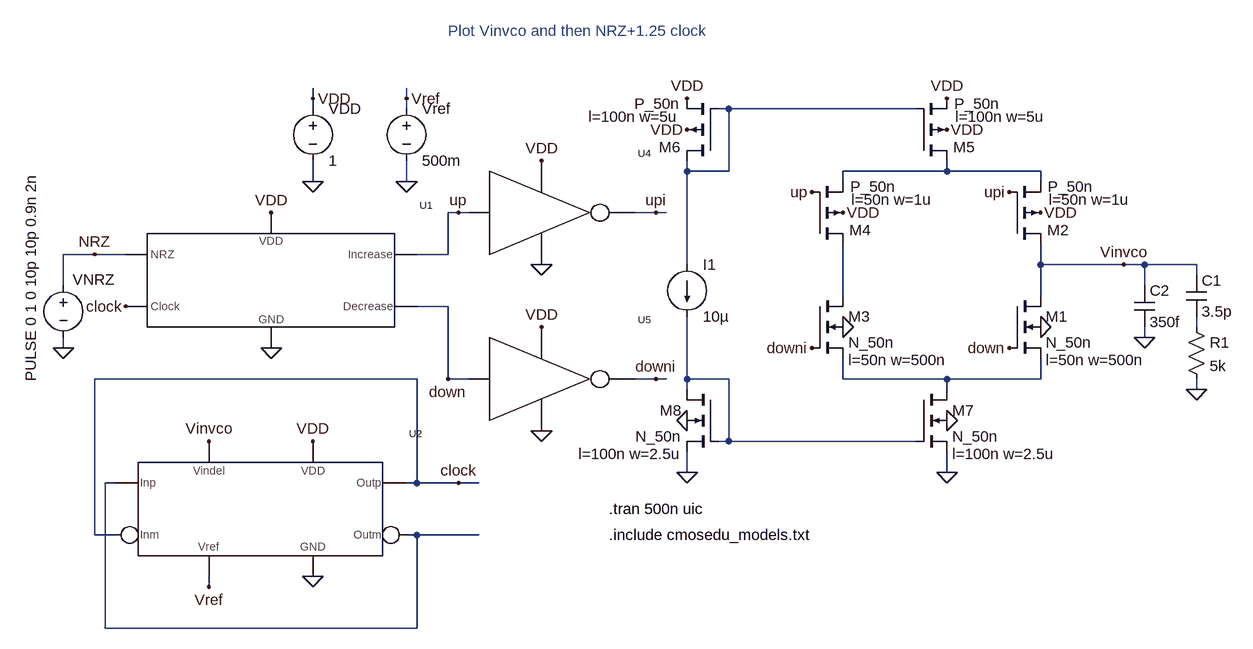
[diagram p0: schematic Fig19_74.asc]
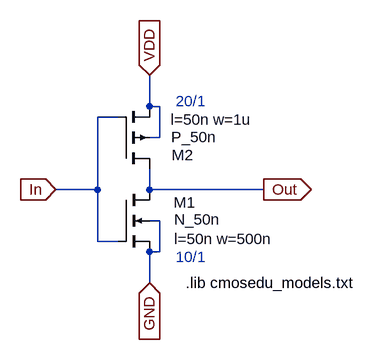
[diagram p1: sub-circuit inv_20_10.asc]
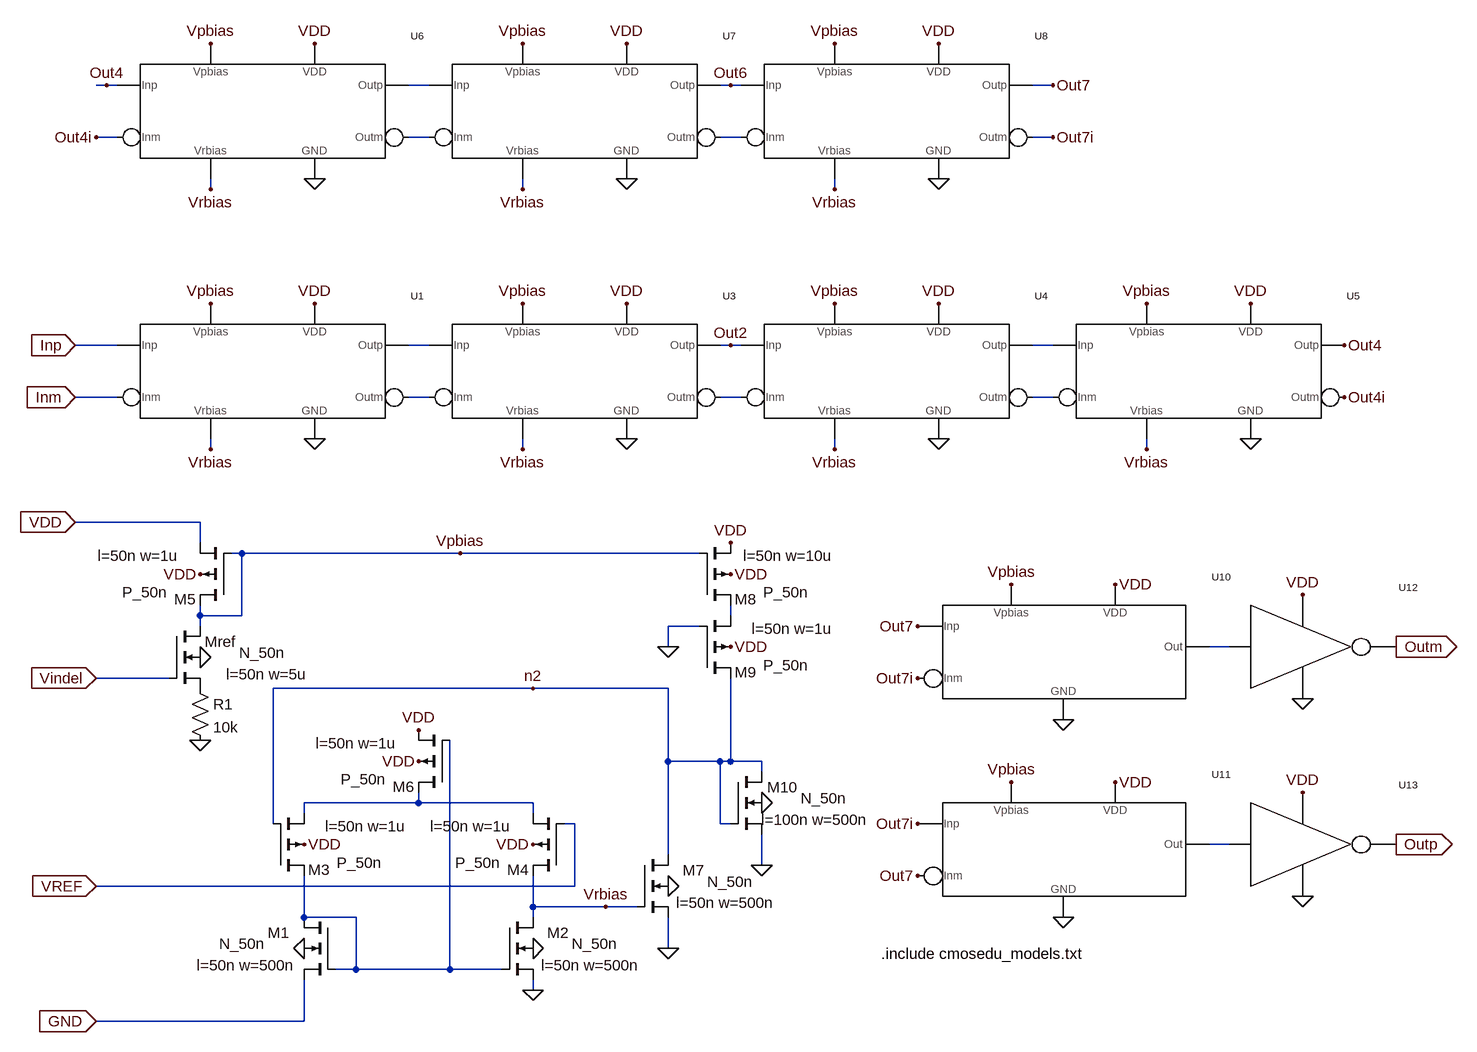
[diagram p2: sub-circuit fig_19_63.asc]
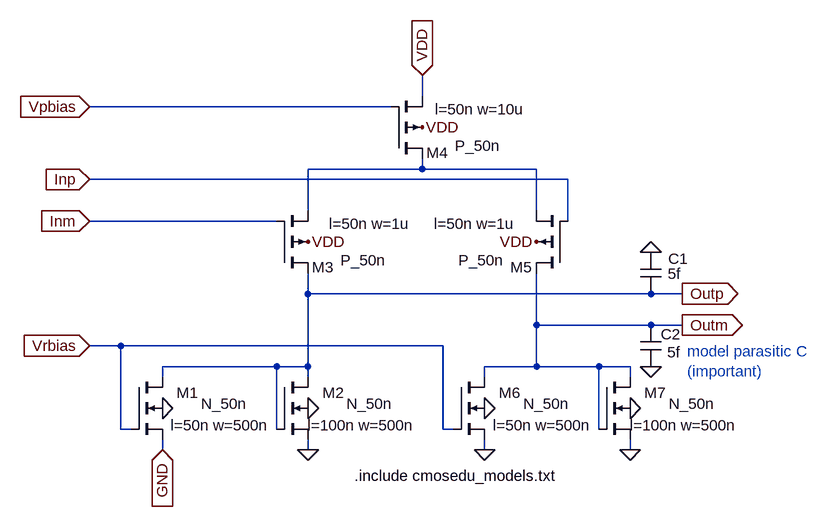
[diagram p3: sub-circuit delay.asc]
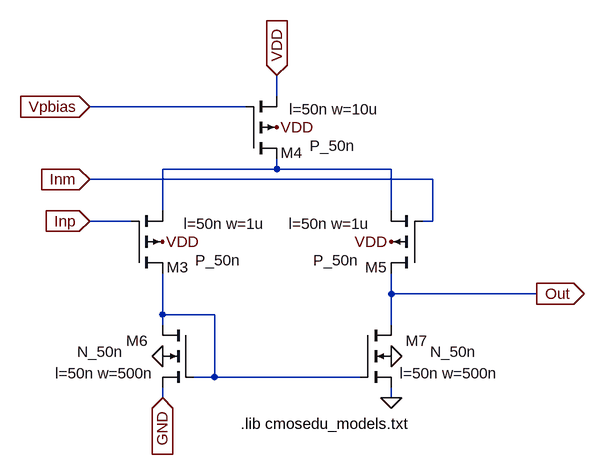
[diagram p4: sub-circuit pdiff.asc]
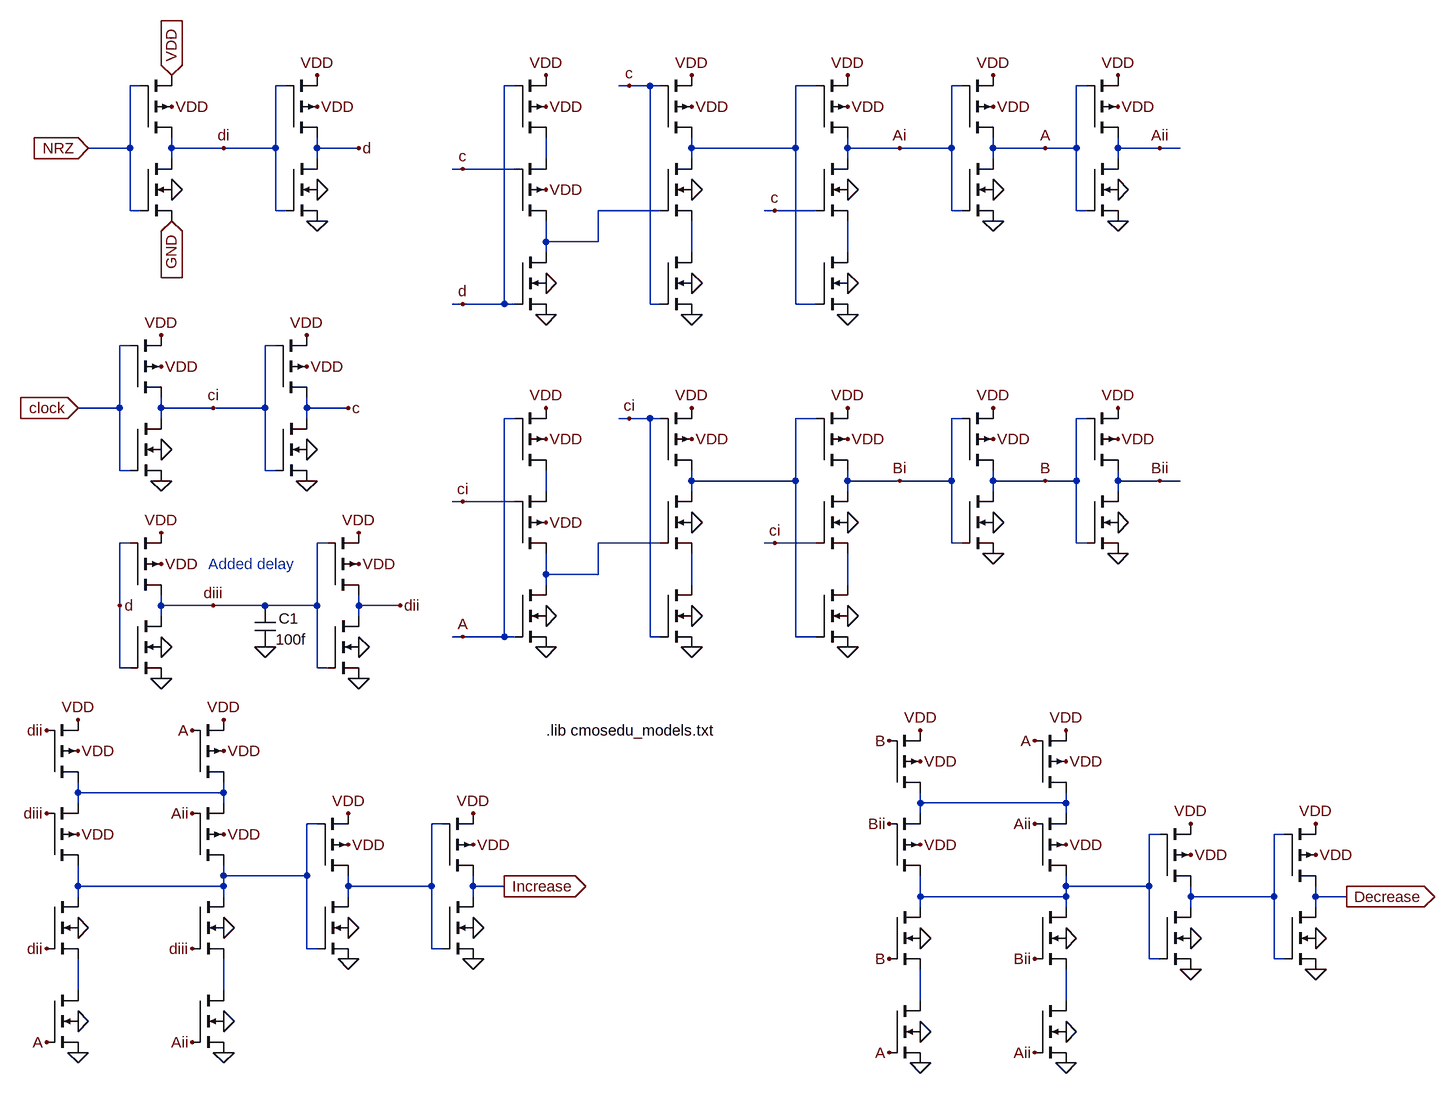
[diagram p5: sub-circuit hogge_pd.asc]
Fig19_74.asc, the LTspice schematic file:
Version 4
SHEET 1 6288 680
WIRE 1760 -1136 1760 -1152
WIRE 1904 -1136 1904 -1152
WIRE 1760 -1120 1760 -1136
WIRE 1904 -1120 1904 -1136
WIRE 2400 -1120 2384 -1120
WIRE 2688 -1120 2400 -1120
WIRE 2336 -1024 2336 -1040
WIRE 2400 -1024 2400 -1120
WIRE 2400 -1024 2336 -1024
WIRE 2736 -1024 2736 -1040
WIRE 2736 -1024 2576 -1024
WIRE 2880 -1024 2736 -1024
WIRE 1760 -1008 1760 -1040
WIRE 1904 -1008 1904 -1040
WIRE 2576 -1008 2576 -1024
WIRE 2880 -1008 2880 -1024
WIRE 1984 -960 1968 -960
WIRE 2000 -960 1984 -960
WIRE 2288 -960 2256 -960
WIRE 2304 -960 2288 -960
WIRE 1424 -896 1376 -896
WIRE 1472 -896 1424 -896
WIRE 1968 -896 1968 -960
WIRE 1968 -896 1920 -896
WIRE 2336 -880 2336 -1024
WIRE 2880 -880 2880 -912
WIRE 3008 -880 2880 -880
WIRE 3040 -880 3008 -880
WIRE 3120 -880 3040 -880
WIRE 3120 -864 3120 -880
WIRE 1376 -848 1376 -896
WIRE 3040 -848 3040 -880
WIRE 2576 -832 2576 -912
WIRE 2880 -832 2880 -880
WIRE 1968 -816 1920 -816
WIRE 3120 -784 3120 -800
WIRE 3040 -768 3040 -784
WIRE 1376 -752 1376 -768
WIRE 1920 -704 1424 -704
WIRE 1968 -704 1968 -816
WIRE 2000 -704 1968 -704
WIRE 2288 -704 2256 -704
WIRE 2304 -704 2288 -704
WIRE 2336 -704 2336 -800
WIRE 2400 -704 2336 -704
WIRE 2576 -704 2576 -736
WIRE 2736 -704 2576 -704
WIRE 2880 -704 2880 -736
WIRE 2880 -704 2736 -704
WIRE 2336 -688 2336 -704
WIRE 2736 -688 2736 -704
WIRE 3120 -688 3120 -704
WIRE 2400 -608 2400 -704
WIRE 2400 -608 2384 -608
WIRE 2688 -608 2400 -608
WIRE 2336 -560 2336 -592
WIRE 2736 -560 2736 -592
WIRE 1456 -544 1440 -544
WIRE 1920 -544 1920 -704
WIRE 1920 -544 1904 -544
WIRE 1984 -544 1920 -544
WIRE 2016 -544 1984 -544
WIRE 1424 -464 1424 -704
WIRE 1456 -464 1424 -464
WIRE 1920 -464 1904 -464
WIRE 2016 -464 1920 -464
WIRE 1600 -384 1600 -400
WIRE 1440 -320 1440 -544
WIRE 1920 -320 1920 -464
WIRE 1920 -320 1440 -320
FLAG 1376 -752 0
FLAG 1760 -1008 0
FLAG 1760 -1136 VDD
FLAG 1696 -960 VDD
FLAG 1696 -752 0
FLAG 1424 -896 NRZ
FLAG 2112 -1040 VDD
FLAG 2112 -880 0
FLAG 2880 -784 0
FLAG 2880 -960 VDD
FLAG 2112 -784 VDD
FLAG 2112 -624 0
FLAG 1984 -960 up
FLAG 2288 -960 upi
FLAG 1968 -704 down
FLAG 2288 -704 downi
FLAG 3040 -768 0
FLAG 2832 -992 upi
FLAG 2832 -752 down
FLAG 2576 -784 0
FLAG 2576 -960 VDD
FLAG 2528 -992 up
FLAG 2528 -752 downi
FLAG 2736 -1136 VDD
FLAG 2736 -1088 VDD
FLAG 2336 -1136 VDD
FLAG 2336 -1088 VDD
FLAG 2736 -640 0
FLAG 2736 -560 0
FLAG 2336 -640 0
FLAG 2336 -560 0
FLAG 1472 -816 clock
FLAG 1904 -1008 0
FLAG 1904 -1136 Vref
FLAG 3008 -880 Vinvco
FLAG 1760 -400 0
FLAG 1760 -608 VDD
FLAG 1600 -608 Vinvco
FLAG 1600 -384 Vref
FLAG 1984 -544 clock
FLAG 3120 -688 0
SYMBOL voltage 1376 -864 R0
WINDOW 0 14 7 Left 2
WINDOW 3 -50 164 VLeft 2
WINDOW 123 0 0 Left 2
WINDOW 39 0 0 Left 2
SYMATTR InstName VNRZ
SYMATTR Value PULSE 0 1 0 10p 10p 0.9n 2n
SYMBOL voltage 1760 -1136 R0
WINDOW 123 0 0 Left 2
WINDOW 39 0 0 Left 2
SYMATTR InstName VDD
SYMATTR Value 1
SYMBOL INV_20_10 2032 -1024 R0
SYMATTR InstName U4
SYMBOL nmos4 2832 -832 R0
WINDOW 123 56 99 Left 2
SYMATTR Value2 l=50n w=500n
SYMATTR InstName M1
SYMATTR Value N_50n
SYMBOL pmos4 2832 -912 M180
WINDOW 0 58 21 Left 2
WINDOW 3 59 88 Left 2
WINDOW 123 61 68 Left 2
SYMATTR InstName M2
SYMATTR Value P_50n
SYMATTR Value2 l=50n w=1u
SYMBOL INV_20_10 2032 -768 R0
SYMATTR InstName U5
SYMBOL cap 3024 -848 R0
SYMATTR InstName C2
SYMATTR Value 350f
SYMBOL nmos4 2528 -832 R0
WINDOW 123 56 99 Left 2
SYMATTR Value2 l=50n w=500n
SYMATTR InstName M3
SYMATTR Value N_50n
SYMBOL pmos4 2528 -912 M180
WINDOW 0 58 21 Left 2
WINDOW 3 59 88 Left 2
WINDOW 123 61 68 Left 2
SYMATTR InstName M4
SYMATTR Value P_50n
SYMATTR Value2 l=50n w=1u
SYMBOL pmos4 2688 -1040 M180
WINDOW 0 58 21 Left 2
WINDOW 3 59 88 Left 2
WINDOW 123 61 68 Left 2
SYMATTR InstName M5
SYMATTR Value P_50n
SYMATTR Value2 l=100n w=5u
SYMBOL pmos4 2384 -1040 R180
WINDOW 0 58 21 Left 2
WINDOW 3 59 88 Left 2
WINDOW 123 61 68 Left 2
SYMATTR InstName M6
SYMATTR Value P_50n
SYMATTR Value2 l=100n w=5u
SYMBOL nmos4 2688 -688 R0
WINDOW 123 56 99 Left 2
SYMATTR Value2 l=100n w=2.5u
SYMATTR InstName M7
SYMATTR Value N_50n
SYMBOL nmos4 2384 -688 M0
WINDOW 123 56 99 Left 2
SYMATTR Value2 l=100n w=2.5u
SYMATTR InstName M8
SYMATTR Value N_50n
SYMBOL current 2336 -880 R0
SYMATTR InstName I1
SYMATTR Value 10µ
SYMBOL voltage 1904 -1136 R0
WINDOW 123 0 0 Left 2
WINDOW 39 0 0 Left 2
SYMATTR InstName Vref
SYMATTR Value 500m
SYMBOL Fig_19_63 1488 -496 R0
SYMATTR InstName U2
SYMBOL cap 3104 -864 R0
SYMATTR InstName C1
SYMATTR Value 3.5p
SYMBOL res 3104 -800 R0
SYMATTR InstName R1
SYMATTR Value 5k
SYMBOL Hogge_PD 1504 -848 R0
SYMATTR InstName U1
TEXT 2216 -504 Left 2 !.tran 500n uic
TEXT 2216 -464 Left 2 !.include cmosedu_models.txt
TEXT 1968 -1240 Left 2 ;Plot Vinvco and then NRZ+1.25 clock

inv_20_10.asc, the sub-circuit schematic file:
Version 4
SHEET 1 1136 680
WIRE 448 -304 448 -352
WIRE 464 -304 448 -304
WIRE 400 -288 368 -288
WIRE 464 -256 464 -304
WIRE 464 -256 448 -256
WIRE 368 -176 368 -288
WIRE 368 -176 304 -176
WIRE 448 -176 448 -208
WIRE 624 -176 448 -176
WIRE 464 -128 448 -128
WIRE 368 -96 368 -176
WIRE 400 -96 368 -96
WIRE 464 -80 464 -128
WIRE 464 -80 448 -80
WIRE 448 -32 448 -80
FLAG 304 -176 In
IOPIN 304 -176 In
FLAG 448 -352 VDD
IOPIN 448 -352 In
FLAG 448 -32 GND
IOPIN 448 -32 In
FLAG 624 -176 Out
IOPIN 624 -176 Out
SYMBOL nmos4 400 -176 R0
WINDOW 0 119 20 Right 2
WINDOW 3 157 46 Right 2
WINDOW 123 238 76 Right 2
SYMATTR InstName M1
SYMATTR Value N_50n
SYMATTR Value2 l=50n w=500n
SYMBOL pmos4 400 -208 M180
WINDOW 0 116 21 Right 2
WINDOW 3 151 49 Right 2
WINDOW 123 206 76 Right 2
SYMATTR InstName M2
SYMATTR Value P_50n
SYMATTR Value2 l=50n w=1u
TEXT 488 -312 Left 2 ;20/1
TEXT 488 -72 Left 2 ;10/1
TEXT 504 -32 Left 2 !.lib cmosedu_models.txt

fig_19_63.asc, the sub-circuit schematic file:
Version 4
SHEET 1 4588 680
WIRE 656 -1792 640 -1792
WIRE 672 -1792 656 -1792
WIRE 1152 -1792 1120 -1792
WIRE 1616 -1792 1600 -1792
WIRE 1632 -1792 1616 -1792
WIRE 2112 -1792 2080 -1792
WIRE 672 -1712 640 -1712
WIRE 1152 -1712 1120 -1712
WIRE 1632 -1712 1600 -1712
WIRE 2112 -1712 2080 -1712
WIRE 816 -1632 816 -1648
WIRE 1296 -1632 1296 -1648
WIRE 1776 -1632 1776 -1648
WIRE 672 -1392 608 -1392
WIRE 1152 -1392 1120 -1392
WIRE 1616 -1392 1600 -1392
WIRE 1632 -1392 1616 -1392
WIRE 2112 -1392 2080 -1392
WIRE 672 -1312 608 -1312
WIRE 1152 -1312 1120 -1312
WIRE 1632 -1312 1600 -1312
WIRE 2112 -1312 2080 -1312
WIRE 816 -1232 816 -1248
WIRE 1296 -1232 1296 -1248
WIRE 1776 -1232 1776 -1248
WIRE 2256 -1232 2256 -1248
WIRE 800 -1120 608 -1120
WIRE 800 -1088 800 -1120
WIRE 864 -1072 848 -1072
WIRE 1200 -1072 864 -1072
WIRE 1568 -1072 1200 -1072
WIRE 800 -976 800 -992
WIRE 864 -976 864 -1072
WIRE 864 -976 800 -976
WIRE 1616 -976 1616 -992
WIRE 800 -960 800 -976
WIRE 1568 -960 1520 -960
WIRE 1520 -928 1520 -960
WIRE 2384 -928 2352 -928
WIRE 752 -880 640 -880
WIRE 1312 -864 912 -864
WIRE 1520 -864 1312 -864
WIRE 1520 -752 1520 -864
WIRE 1600 -752 1520 -752
WIRE 1616 -752 1616 -880
WIRE 1616 -752 1600 -752
WIRE 1664 -752 1616 -752
WIRE 1664 -736 1664 -752
WIRE 1136 -688 1136 -704
WIRE 1136 -688 960 -688
WIRE 1312 -688 1136 -688
WIRE 960 -672 960 -688
WIRE 1312 -672 1312 -688
WIRE 912 -656 912 -864
WIRE 1376 -656 1360 -656
WIRE 1600 -656 1600 -752
WIRE 1616 -656 1600 -656
WIRE 2384 -624 2352 -624
WIRE 1520 -608 1520 -752
WIRE 1664 -592 1664 -640
WIRE 1376 -560 1376 -656
WIRE 1376 -560 640 -560
WIRE 1312 -528 1312 -576
WIRE 1424 -528 1312 -528
WIRE 1472 -528 1424 -528
WIRE 960 -512 960 -576
WIRE 1040 -512 960 -512
WIRE 1312 -512 1312 -528
WIRE 1520 -464 1520 -512
WIRE 1040 -432 1040 -512
WIRE 1040 -432 1008 -432
WIRE 1184 -432 1184 -784
WIRE 1184 -432 1040 -432
WIRE 1264 -432 1184 -432
WIRE 1312 -400 1312 -416
WIRE 960 -352 960 -416
WIRE 960 -352 640 -352
FLAG 960 -464 0
FLAG 960 -624 VDD
FLAG 1312 -624 VDD
FLAG 1312 -464 0
FLAG 800 -1040 VDD
FLAG 1520 -560 0
FLAG 1520 -464 0
FLAG 1136 -752 VDD
FLAG 1136 -800 VDD
FLAG 1312 -400 0
FLAG 800 -912 0
FLAG 800 -784 0
FLAG 1616 -1040 VDD
FLAG 1616 -1088 VDD
FLAG 1616 -928 VDD
FLAG 1520 -928 0
FLAG 1664 -688 0
FLAG 1664 -592 0
FLAG 1424 -528 Vrbias
FLAG 1312 -864 n2
FLAG 1200 -1072 Vpbias
FLAG 976 -1456 VDD
FLAG 976 -1248 0
FLAG 816 -1456 Vpbias
FLAG 816 -1232 Vrbias
FLAG 1456 -1456 VDD
FLAG 1456 -1248 0
FLAG 1296 -1456 Vpbias
FLAG 1296 -1232 Vrbias
FLAG 1936 -1456 VDD
FLAG 1936 -1248 0
FLAG 1776 -1456 Vpbias
FLAG 1776 -1232 Vrbias
FLAG 2416 -1456 VDD
FLAG 2416 -1248 0
FLAG 2256 -1456 Vpbias
FLAG 2256 -1232 Vrbias
FLAG 976 -1856 VDD
FLAG 976 -1648 0
FLAG 816 -1856 Vpbias
FLAG 816 -1632 Vrbias
FLAG 1456 -1856 VDD
FLAG 1456 -1648 0
FLAG 1296 -1856 Vpbias
FLAG 1296 -1632 Vrbias
FLAG 1936 -1856 VDD
FLAG 1936 -1648 0
FLAG 1776 -1856 Vpbias
FLAG 1776 -1632 Vrbias
FLAG 1616 -1392 Out2
FLAG 656 -1792 Out4
FLAG 1616 -1792 Out6
FLAG 2560 -1392 Out4
FLAG 2560 -1312 Out4i
FLAG 640 -1712 Out4i
FLAG 2128 -816 0
FLAG 2128 -512 0
FLAG 2208 -1024 VDD
FLAG 2208 -720 VDD
FLAG 1904 -960 Out7
FLAG 1904 -576 Out7
FLAG 1904 -880 Out7i
FLAG 1904 -656 Out7i
FLAG 2048 -1024 Vpbias
FLAG 2048 -720 Vpbias
FLAG 2496 -848 0
FLAG 2496 -544 0
FLAG 2496 -1008 VDD
FLAG 2496 -704 VDD
FLAG 2640 -928 Outm
IOPIN 2640 -928 Out
FLAG 2640 -624 Outp
IOPIN 2640 -624 Out
FLAG 640 -880 Vindel
IOPIN 640 -880 In
FLAG 640 -560 VREF
IOPIN 640 -560 In
FLAG 608 -1392 Inp
IOPIN 608 -1392 In
FLAG 608 -1312 Inm
IOPIN 608 -1312 In
FLAG 608 -1120 VDD
IOPIN 608 -1120 In
FLAG 640 -352 GND
IOPIN 640 -352 In
FLAG 2112 -1792 Out7
FLAG 2112 -1712 Out7i
SYMBOL nmos4 1008 -512 M0
WINDOW 0 104 24 Right 2
WINDOW 3 179 41 Right 2
WINDOW 123 213 74 Right 2
SYMATTR InstName M1
SYMATTR Value N_50n
SYMATTR Value2 l=50n w=500n
SYMBOL pmos4 912 -576 M180
WINDOW 0 88 9 Right 2
WINDOW 3 168 20 Right 2
WINDOW 123 206 76 Right 2
SYMATTR InstName M3
SYMATTR Value P_50n
SYMATTR Value2 l=50n w=1u
SYMBOL pmos4 1360 -576 R180
WINDOW 0 88 9 Right 2
WINDOW 3 168 20 Right 2
WINDOW 123 206 76 Right 2
SYMATTR InstName M4
SYMATTR Value P_50n
SYMATTR Value2 l=50n w=1u
SYMBOL nmos4 1264 -512 R0
WINDOW 0 104 24 Right 2
WINDOW 3 179 41 Right 2
WINDOW 123 213 74 Right 2
SYMATTR InstName M2
SYMATTR Value N_50n
SYMATTR Value2 l=50n w=500n
SYMBOL pmos4 848 -992 R180
WINDOW 0 88 9 Right 2
WINDOW 3 168 20 Right 2
WINDOW 123 206 76 Right 2
SYMATTR InstName M5
SYMATTR Value P_50n
SYMATTR Value2 l=50n w=1u
SYMBOL nmos4 1472 -608 R0
WINDOW 0 104 24 Right 2
WINDOW 3 179 41 Right 2
WINDOW 123 213 74 Right 2
SYMATTR InstName M7
SYMATTR Value N_50n
SYMATTR Value2 l=50n w=500n
SYMBOL pmos4 1184 -704 R180
WINDOW 0 88 9 Right 2
WINDOW 3 168 20 Right 2
WINDOW 123 206 76 Right 2
SYMATTR InstName M6
SYMATTR Value P_50n
SYMATTR Value2 l=50n w=1u
SYMBOL nmos4 752 -960 R0
WINDOW 0 104 24 Right 2
WINDOW 3 179 41 Right 2
WINDOW 123 213 74 Right 2
SYMATTR InstName Mref
SYMATTR Value N_50n
SYMATTR Value2 l=50n w=5u
SYMBOL res 784 -880 R0
SYMATTR InstName R1
SYMATTR Value 10k
SYMBOL pmos4 1568 -992 M180
WINDOW 0 88 9 Right 2
WINDOW 3 168 20 Right 2
WINDOW 123 206 76 Right 2
SYMATTR InstName M8
SYMATTR Value P_50n
SYMATTR Value2 l=50n w=10u
SYMBOL pmos4 1568 -880 M180
WINDOW 0 88 9 Right 2
WINDOW 3 168 20 Right 2
WINDOW 123 206 76 Right 2
SYMATTR InstName M9
SYMATTR Value P_50n
SYMATTR Value2 l=50n w=1u
SYMBOL nmos4 1616 -736 R0
WINDOW 0 104 24 Right 2
WINDOW 3 179 41 Right 2
WINDOW 123 213 74 Right 2
SYMATTR InstName M10
SYMATTR Value N_50n
SYMATTR Value2 l=100n w=500n
SYMBOL delay 704 -1344 R0
SYMATTR InstName U1
SYMBOL delay 1184 -1344 R0
SYMATTR InstName U3
SYMBOL delay 1664 -1344 R0
SYMATTR InstName U4
SYMBOL delay 2144 -1344 R0
SYMATTR InstName U5
SYMBOL delay 704 -1744 R0
SYMATTR InstName U6
SYMBOL delay 1184 -1744 R0
SYMATTR InstName U7
SYMBOL delay 1664 -1744 R0
SYMATTR InstName U8
SYMBOL pdiff 1936 -912 R0
SYMATTR InstName U10
SYMBOL pdiff 1936 -608 R0
SYMATTR InstName U11
SYMBOL INV_20_10 2416 -992 R0
SYMATTR InstName U12
SYMBOL INV_20_10 2416 -688 R0
SYMATTR InstName U13
TEXT 1848 -456 Left 2 !.include cmosedu_models.txt

delay.asc, the sub-circuit schematic file:
Version 4
SHEET 1 6288 680
WIRE 656 -608 656 -640
WIRE 608 -592 144 -592
WIRE 656 -496 656 -512
WIRE 656 -496 480 -496
WIRE 832 -496 656 -496
WIRE 880 -480 144 -480
WIRE 480 -432 480 -496
WIRE 832 -432 832 -496
WIRE 432 -416 144 -416
WIRE 880 -416 880 -480
WIRE 480 -304 480 -336
WIRE 1008 -304 480 -304
WIRE 1056 -304 1008 -304
WIRE 832 -256 832 -336
WIRE 1008 -256 832 -256
WIRE 1056 -256 1008 -256
WIRE 192 -224 144 -224
WIRE 688 -224 192 -224
WIRE 432 -192 256 -192
WIRE 480 -192 480 -304
WIRE 480 -192 432 -192
WIRE 832 -192 832 -256
WIRE 832 -192 752 -192
WIRE 928 -192 832 -192
WIRE 976 -192 928 -192
WIRE 256 -176 256 -192
WIRE 480 -176 480 -192
WIRE 752 -176 752 -192
WIRE 976 -176 976 -192
WIRE 192 -96 192 -224
WIRE 208 -96 192 -96
WIRE 432 -96 432 -192
WIRE 688 -96 688 -224
WIRE 704 -96 688 -96
WIRE 928 -96 928 -192
WIRE 256 -64 256 -80
WIRE 480 -64 480 -80
WIRE 752 -64 752 -80
WIRE 976 -64 976 -80
FLAG 256 -128 0
FLAG 656 -560 VDD
FLAG 480 -384 VDD
FLAG 480 -128 0
FLAG 144 -592 Vpbias
IOPIN 144 -592 In
FLAG 656 -640 VDD
IOPIN 656 -640 In
FLAG 832 -384 VDD
FLAG 144 -416 Inm
IOPIN 144 -416 In
FLAG 144 -480 Inp
IOPIN 144 -480 In
FLAG 480 -64 0
FLAG 752 -128 0
FLAG 976 -128 0
FLAG 976 -64 0
FLAG 752 -64 0
FLAG 144 -224 Vrbias
IOPIN 144 -224 In
FLAG 1056 -304 Outp
IOPIN 1056 -304 Out
FLAG 1056 -256 Outm
IOPIN 1056 -256 Out
FLAG 256 -64 GND
IOPIN 256 -64 In
FLAG 1008 -192 0
FLAG 1008 -368 0
SYMBOL nmos4 208 -176 R0
WINDOW 0 104 24 Right 0
WINDOW 3 179 41 Right 0
WINDOW 123 213 74 Right 0
SYMATTR InstName M1
SYMATTR Value N_50n
SYMATTR Value2 l=50n w=500n
SYMBOL pmos4 608 -512 M180
WINDOW 0 88 9 Right 0
WINDOW 3 168 20 Right 0
WINDOW 123 206 76 Right 0
SYMATTR InstName M4
SYMATTR Value P_50n
SYMATTR Value2 l=50n w=10u
SYMBOL pmos4 432 -336 M180
WINDOW 0 88 9 Right 0
WINDOW 3 168 20 Right 0
WINDOW 123 206 76 Right 0
SYMATTR InstName M3
SYMATTR Value P_50n
SYMATTR Value2 l=50n w=1u
SYMBOL nmos4 432 -176 R0
WINDOW 0 104 24 Right 0
WINDOW 3 179 41 Right 0
WINDOW 123 213 74 Right 0
SYMATTR InstName M2
SYMATTR Value N_50n
SYMATTR Value2 l=100n w=500n
SYMBOL pmos4 880 -336 R180
WINDOW 0 88 9 Right 0
WINDOW 3 168 20 Right 0
WINDOW 123 206 76 Right 0
SYMATTR InstName M5
SYMATTR Value P_50n
SYMATTR Value2 l=50n w=1u
SYMBOL nmos4 704 -176 R0
WINDOW 0 104 24 Right 0
WINDOW 3 179 41 Right 0
WINDOW 123 213 74 Right 0
SYMATTR InstName M6
SYMATTR Value N_50n
SYMATTR Value2 l=50n w=500n
SYMBOL nmos4 928 -176 R0
WINDOW 0 104 24 Right 0
WINDOW 3 179 41 Right 0
WINDOW 123 213 74 Right 0
SYMATTR InstName M7
SYMATTR Value N_50n
SYMATTR Value2 l=100n w=500n
SYMBOL cap 992 -368 R0
WINDOW 0 43 10 Left 0
WINDOW 3 42 33 Left 0
SYMATTR InstName C1
SYMATTR Value 5f
SYMBOL cap 992 -256 R0
WINDOW 0 31 14 Left 0
WINDOW 3 41 42 Left 0
SYMATTR InstName C2
SYMATTR Value 5f
TEXT 552 -24 Left 0 !.include cmosedu_models.txt
TEXT 1064 -216 Left 0 ;model parasitic C\n(important)

pdiff.asc, the sub-circuit schematic file:
Version 4
SHEET 1 6288 680
WIRE 432 -416 368 -416
WIRE 480 -432 480 -496
WIRE 480 -272 480 -336
WIRE 480 -256 480 -272
WIRE 480 -144 480 -160
WIRE 560 -272 480 -272
WIRE 560 -176 528 -176
WIRE 560 -176 560 -272
WIRE 608 -592 368 -592
WIRE 656 -608 656 -640
WIRE 656 -496 480 -496
WIRE 656 -496 656 -512
WIRE 784 -176 560 -176
WIRE 832 -496 656 -496
WIRE 832 -432 832 -496
WIRE 832 -304 832 -336
WIRE 832 -256 832 -304
WIRE 832 -144 832 -160
WIRE 896 -480 368 -480
WIRE 896 -416 880 -416
WIRE 896 -416 896 -480
WIRE 1056 -304 832 -304
FLAG 656 -560 VDD
FLAG 480 -384 VDD
FLAG 368 -592 Vpbias
IOPIN 368 -592 In
FLAG 656 -640 VDD
IOPIN 656 -640 In
FLAG 832 -384 VDD
FLAG 368 -416 Inp
IOPIN 368 -416 In
FLAG 368 -480 Inm
IOPIN 368 -480 In
FLAG 480 -208 0
FLAG 832 -208 0
FLAG 832 -144 0
FLAG 1056 -304 Out
IOPIN 1056 -304 Out
FLAG 480 -144 GND
IOPIN 480 -144 In
SYMBOL pmos4 608 -512 M180
WINDOW 0 88 9 Right 0
WINDOW 3 168 20 Right 0
WINDOW 123 206 76 Right 0
SYMATTR InstName M4
SYMATTR Value P_50n
SYMATTR Value2 l=50n w=10u
SYMBOL pmos4 432 -336 M180
WINDOW 0 88 9 Right 0
WINDOW 3 168 20 Right 0
WINDOW 123 206 76 Right 0
SYMATTR InstName M3
SYMATTR Value P_50n
SYMATTR Value2 l=50n w=1u
SYMBOL pmos4 880 -336 R180
WINDOW 0 88 9 Right 0
WINDOW 3 168 20 Right 0
WINDOW 123 206 76 Right 0
SYMATTR InstName M5
SYMATTR Value P_50n
SYMATTR Value2 l=50n w=1u
SYMBOL nmos4 528 -256 M0
WINDOW 0 104 24 Right 0
WINDOW 3 179 41 Right 0
WINDOW 123 213 74 Right 0
SYMATTR InstName M6
SYMATTR Value N_50n
SYMATTR Value2 l=50n w=500n
SYMBOL nmos4 784 -256 R0
WINDOW 0 104 24 Right 0
WINDOW 3 179 41 Right 0
WINDOW 123 213 74 Right 0
SYMATTR InstName M7
SYMATTR Value N_50n
SYMATTR Value2 l=50n w=500n
TEXT 600 -104 Left 0 !.lib cmosedu_models.txt

hogge_pd.asc, the sub-circuit schematic file:
Version 4
SHEET 1 6288 1628
WIRE 336 544 336 528
WIRE 336 560 336 544
WIRE 336 688 336 656
WIRE 336 704 336 688
WIRE 336 848 336 800
WIRE 400 -48 336 -48
WIRE 400 -48 400 -144
WIRE 400 48 400 -48
WIRE 400 256 400 160
WIRE 400 352 400 256
WIRE 416 -448 352 -448
WIRE 416 -448 416 -544
WIRE 416 -352 416 -448
WIRE 416 -144 400 -144
WIRE 416 48 400 48
WIRE 416 160 400 160
WIRE 416 352 400 352
WIRE 432 -544 416 -544
WIRE 432 -352 416 -352
WIRE 464 -48 464 -64
WIRE 464 -32 464 -48
WIRE 464 256 464 240
WIRE 464 272 464 256
WIRE 480 -448 480 -464
WIRE 480 -432 480 -448
WIRE 544 -48 464 -48
WIRE 544 256 464 256
WIRE 560 -448 480 -448
WIRE 560 544 336 544
WIRE 560 544 560 528
WIRE 560 560 560 544
WIRE 560 672 560 656
WIRE 560 688 336 688
WIRE 560 688 560 672
WIRE 560 704 560 688
WIRE 560 848 560 800
WIRE 624 -48 544 -48
WIRE 624 -48 624 -144
WIRE 624 48 624 -48
WIRE 624 256 544 256
WIRE 640 -448 560 -448
WIRE 640 -448 640 -544
WIRE 640 -352 640 -448
WIRE 640 -144 624 -144
WIRE 640 48 624 48
WIRE 656 -544 640 -544
WIRE 656 -352 640 -352
WIRE 688 -48 688 -64
WIRE 688 -32 688 -48
WIRE 688 672 560 672
WIRE 688 672 688 592
WIRE 688 784 688 672
WIRE 704 -448 704 -464
WIRE 704 -432 704 -448
WIRE 704 256 624 256
WIRE 704 256 704 160
WIRE 704 352 704 256
WIRE 704 592 688 592
WIRE 704 784 688 784
WIRE 720 160 704 160
WIRE 720 352 704 352
WIRE 752 -48 688 -48
WIRE 752 688 752 672
WIRE 752 704 752 688
WIRE 768 -448 704 -448
WIRE 768 256 768 240
WIRE 768 272 768 256
WIRE 832 256 768 256
WIRE 880 688 752 688
WIRE 880 688 880 592
WIRE 880 784 880 688
WIRE 896 592 880 592
WIRE 896 784 880 784
WIRE 928 -416 912 -416
WIRE 928 -208 912 -208
WIRE 928 96 912 96
WIRE 928 304 912 304
WIRE 944 688 944 672
WIRE 944 704 944 688
WIRE 992 -208 928 -208
WIRE 992 -208 992 -544
WIRE 992 304 928 304
WIRE 992 304 992 -32
WIRE 992 688 944 688
WIRE 1008 -544 992 -544
WIRE 1008 -416 928 -416
WIRE 1008 -208 992 -208
WIRE 1008 -32 992 -32
WIRE 1008 96 928 96
WIRE 1008 304 992 304
WIRE 1056 -432 1056 -464
WIRE 1056 -304 1056 -336
WIRE 1056 -288 1056 -304
WIRE 1056 80 1056 48
WIRE 1056 208 1056 176
WIRE 1056 224 1056 208
WIRE 1136 -304 1056 -304
WIRE 1136 -304 1136 -352
WIRE 1136 208 1056 208
WIRE 1136 208 1136 160
WIRE 1184 -544 1168 -544
WIRE 1184 -32 1168 -32
WIRE 1216 -544 1184 -544
WIRE 1216 -208 1216 -544
WIRE 1216 -32 1184 -32
WIRE 1216 304 1216 -32
WIRE 1232 -544 1216 -544
WIRE 1232 -352 1136 -352
WIRE 1232 -208 1216 -208
WIRE 1232 -32 1216 -32
WIRE 1232 160 1136 160
WIRE 1232 304 1216 304
WIRE 1280 -448 1280 -464
WIRE 1280 -432 1280 -448
WIRE 1280 -288 1280 -336
WIRE 1280 64 1280 48
WIRE 1280 80 1280 64
WIRE 1280 224 1280 176
WIRE 1408 -352 1392 -352
WIRE 1408 160 1392 160
WIRE 1440 -448 1280 -448
WIRE 1440 -448 1440 -544
WIRE 1440 -208 1440 -448
WIRE 1440 64 1280 64
WIRE 1440 64 1440 -32
WIRE 1440 304 1440 64
WIRE 1472 -544 1440 -544
WIRE 1472 -352 1408 -352
WIRE 1472 -208 1440 -208
WIRE 1472 -32 1440 -32
WIRE 1472 160 1408 160
WIRE 1472 304 1440 304
WIRE 1520 -448 1520 -464
WIRE 1520 -432 1520 -448
WIRE 1520 -288 1520 -336
WIRE 1520 64 1520 48
WIRE 1520 80 1520 64
WIRE 1520 224 1520 176
WIRE 1600 -448 1520 -448
WIRE 1600 64 1520 64
WIRE 1632 560 1632 544
WIRE 1632 576 1632 560
WIRE 1632 704 1632 672
WIRE 1632 720 1632 704
WIRE 1632 864 1632 816
WIRE 1680 -448 1600 -448
WIRE 1680 -448 1680 -544
WIRE 1680 -352 1680 -448
WIRE 1680 64 1600 64
WIRE 1680 64 1680 -32
WIRE 1680 160 1680 64
WIRE 1696 -544 1680 -544
WIRE 1696 -352 1680 -352
WIRE 1696 -32 1680 -32
WIRE 1696 160 1680 160
WIRE 1744 -448 1744 -464
WIRE 1744 -432 1744 -448
WIRE 1744 64 1744 48
WIRE 1744 80 1744 64
WIRE 1824 -448 1744 -448
WIRE 1824 64 1744 64
WIRE 1856 560 1632 560
WIRE 1856 560 1856 544
WIRE 1856 576 1856 560
WIRE 1856 688 1856 672
WIRE 1856 704 1632 704
WIRE 1856 704 1856 688
WIRE 1856 720 1856 704
WIRE 1856 864 1856 816
WIRE 1872 -448 1824 -448
WIRE 1872 -448 1872 -544
WIRE 1872 -352 1872 -448
WIRE 1872 64 1824 64
WIRE 1872 64 1872 -32
WIRE 1872 160 1872 64
WIRE 1888 -544 1872 -544
WIRE 1888 -352 1872 -352
WIRE 1888 -32 1872 -32
WIRE 1888 160 1872 160
WIRE 1936 -448 1936 -464
WIRE 1936 -432 1936 -448
WIRE 1936 64 1936 48
WIRE 1936 80 1936 64
WIRE 1984 688 1856 688
WIRE 1984 688 1984 608
WIRE 1984 800 1984 688
WIRE 2000 -448 1936 -448
WIRE 2000 64 1936 64
WIRE 2000 608 1984 608
WIRE 2000 800 1984 800
WIRE 2032 -448 2000 -448
WIRE 2032 64 2000 64
WIRE 2048 704 2048 688
WIRE 2048 720 2048 704
WIRE 2176 704 2048 704
WIRE 2176 704 2176 608
WIRE 2176 800 2176 704
WIRE 2192 608 2176 608
WIRE 2192 800 2176 800
WIRE 2240 704 2240 688
WIRE 2240 720 2240 704
WIRE 2288 704 2240 704
FLAG 480 -512 VDD
FLAG 1280 -384 0
FLAG 704 -512 VDD
FLAG 1056 -512 VDD
FLAG 1280 -512 VDD
FLAG 1520 -512 VDD
FLAG 1744 -512 VDD
FLAG 1936 -512 VDD
FLAG 1056 -384 VDD
FLAG 480 -384 0
FLAG 704 -384 0
FLAG 1520 -384 0
FLAG 1744 -384 0
FLAG 1936 -384 0
FLAG 1056 -240 0
FLAG 1280 -240 0
FLAG 1520 -240 0
FLAG 1632 496 VDD
FLAG 1856 496 VDD
FLAG 1632 624 VDD
FLAG 1856 624 VDD
FLAG 1632 768 0
FLAG 1856 768 0
FLAG 1632 912 0
FLAG 1856 912 0
FLAG 2048 640 VDD
FLAG 2240 640 VDD
FLAG 2048 768 0
FLAG 2240 768 0
FLAG 480 -560 VDD
IOPIN 480 -560 In
FLAG 480 -336 GND
IOPIN 480 -336 In
FLAG 352 -448 NRZ
IOPIN 352 -448 In
FLAG 704 -336 0
FLAG 704 -560 VDD
FLAG 1056 -560 VDD
FLAG 1280 -560 VDD
FLAG 1520 -560 VDD
FLAG 1744 -560 VDD
FLAG 1936 -560 VDD
FLAG 2240 592 VDD
FLAG 2048 592 VDD
FLAG 1856 448 VDD
FLAG 1632 448 VDD
FLAG 560 -448 di
FLAG 768 -448 d
FLAG 1056 -192 0
FLAG 1280 -192 0
FLAG 1520 -192 0
FLAG 1936 -336 0
FLAG 1744 -336 0
FLAG 2240 816 0
FLAG 2048 816 0
FLAG 1856 960 0
FLAG 1632 960 0
FLAG 2288 704 Decrease
IOPIN 2288 704 Out
FLAG 928 -416 c
FLAG 1184 -544 c
FLAG 1408 -352 c
FLAG 928 -208 d
FLAG 1600 -448 Ai
FLAG 1824 -448 A
FLAG 2000 -448 Aii
FLAG 1584 464 B
FLAG 1584 800 B
FLAG 1584 592 Bii
FLAG 1584 944 A
FLAG 1808 944 Aii
FLAG 1808 800 Bii
FLAG 1808 592 Aii
FLAG 1808 464 A
FLAG 464 -112 VDD
FLAG 1280 128 0
FLAG 688 -112 VDD
FLAG 1056 0 VDD
FLAG 1280 0 VDD
FLAG 1520 0 VDD
FLAG 1744 0 VDD
FLAG 1936 0 VDD
FLAG 1056 128 VDD
FLAG 464 16 0
FLAG 688 16 0
FLAG 1520 128 0
FLAG 1744 128 0
FLAG 1936 128 0
FLAG 1056 272 0
FLAG 1280 272 0
FLAG 1520 272 0
FLAG 336 480 VDD
FLAG 560 480 VDD
FLAG 336 608 VDD
FLAG 560 608 VDD
FLAG 336 752 0
FLAG 560 752 0
FLAG 336 896 0
FLAG 560 896 0
FLAG 752 624 VDD
FLAG 944 624 VDD
FLAG 752 752 0
FLAG 944 752 0
FLAG 336 -48 clock
IOPIN 336 -48 In
FLAG 688 64 0
FLAG 688 -160 VDD
FLAG 1056 -48 VDD
FLAG 1280 -48 VDD
FLAG 1520 -48 VDD
FLAG 1744 -48 VDD
FLAG 1936 -48 VDD
FLAG 944 576 VDD
FLAG 752 576 VDD
FLAG 560 432 VDD
FLAG 336 432 VDD
FLAG 544 -48 ci
FLAG 752 -48 c
FLAG 1056 320 0
FLAG 1280 320 0
FLAG 1520 320 0
FLAG 1936 176 0
FLAG 1744 176 0
FLAG 944 800 0
FLAG 752 800 0
FLAG 560 944 0
FLAG 336 944 0
FLAG 992 688 Increase
IOPIN 992 688 Out
FLAG 928 96 ci
FLAG 1184 -32 ci
FLAG 1408 160 ci
FLAG 928 304 A
FLAG 1600 64 Bi
FLAG 1824 64 B
FLAG 2000 64 Bii
FLAG 288 448 dii
FLAG 288 784 dii
FLAG 288 576 diii
FLAG 288 928 A
FLAG 512 928 Aii
FLAG 512 784 diii
FLAG 512 576 Aii
FLAG 512 448 A
FLAG 464 64 0
FLAG 464 -160 VDD
FLAG 464 192 VDD
FLAG 768 192 VDD
FLAG 464 320 0
FLAG 768 320 0
FLAG 768 368 0
FLAG 768 144 VDD
FLAG 544 256 diii
FLAG 832 256 dii
FLAG 464 368 0
FLAG 464 144 VDD
FLAG 400 256 d
FLAG 624 320 0
SYMBOL pmos4 432 -464 M180
WINDOW 0 88 9 Invisible 0
WINDOW 3 168 20 Invisible 0
SYMATTR InstName M3
SYMATTR Value P_50n
SYMATTR Value2 l=50n w=1u
SYMBOL nmos4 1232 -432 R0
WINDOW 0 104 24 Invisible 0
WINDOW 3 179 41 Invisible 0
SYMATTR InstName M7
SYMATTR Value N_50n
SYMATTR Value2 l=50n w=500n
SYMBOL pmos4 656 -464 M180
WINDOW 0 88 9 Invisible 0
WINDOW 3 168 20 Invisible 0
SYMATTR InstName M1
SYMATTR Value P_50n
SYMATTR Value2 l=50n w=1u
SYMBOL pmos4 1008 -464 M180
WINDOW 0 88 9 Invisible 0
WINDOW 3 168 20 Invisible 0
SYMATTR InstName M2
SYMATTR Value P_50n
SYMATTR Value2 l=50n w=1u
SYMBOL pmos4 1232 -464 M180
WINDOW 0 88 9 Invisible 0
WINDOW 3 168 20 Invisible 0
SYMATTR InstName M4
SYMATTR Value P_50n
SYMATTR Value2 l=50n w=1u
SYMBOL pmos4 1472 -464 M180
WINDOW 0 88 9 Invisible 0
WINDOW 3 168 20 Invisible 0
SYMATTR InstName M5
SYMATTR Value P_50n
SYMATTR Value2 l=50n w=1u
SYMBOL pmos4 1696 -464 M180
WINDOW 0 88 9 Invisible 0
WINDOW 3 168 20 Invisible 0
SYMATTR InstName M6
SYMATTR Value P_50n
SYMATTR Value2 l=50n w=1u
SYMBOL pmos4 1888 -464 M180
WINDOW 0 88 9 Invisible 0
WINDOW 3 168 20 Invisible 0
SYMATTR InstName M8
SYMATTR Value P_50n
SYMATTR Value2 l=50n w=1u
SYMBOL pmos4 1008 -336 M180
WINDOW 0 88 9 Invisible 0
WINDOW 3 168 20 Invisible 0
SYMATTR InstName M9
SYMATTR Value P_50n
SYMATTR Value2 l=50n w=1u
SYMBOL nmos4 432 -432 R0
WINDOW 0 104 24 Invisible 0
WINDOW 3 179 41 Invisible 0
SYMATTR InstName M10
SYMATTR Value N_50n
SYMATTR Value2 l=50n w=500n
SYMBOL nmos4 656 -432 R0
WINDOW 0 104 24 Invisible 0
WINDOW 3 179 41 Invisible 0
SYMATTR InstName M11
SYMATTR Value N_50n
SYMATTR Value2 l=50n w=500n
SYMBOL nmos4 1472 -432 R0
WINDOW 0 104 24 Invisible 0
WINDOW 3 179 41 Invisible 0
SYMATTR InstName M12
SYMATTR Value N_50n
SYMATTR Value2 l=50n w=500n
SYMBOL nmos4 1696 -432 R0
WINDOW 0 104 24 Invisible 0
WINDOW 3 179 41 Invisible 0
SYMATTR InstName M13
SYMATTR Value N_50n
SYMATTR Value2 l=50n w=500n
SYMBOL nmos4 1888 -432 R0
WINDOW 0 104 24 Invisible 0
WINDOW 3 179 41 Invisible 0
SYMATTR InstName M14
SYMATTR Value N_50n
SYMATTR Value2 l=50n w=500n
SYMBOL nmos4 1008 -288 R0
WINDOW 0 104 24 Invisible 0
WINDOW 3 179 41 Invisible 0
SYMATTR InstName M15
SYMATTR Value N_50n
SYMATTR Value2 l=50n w=500n
SYMBOL nmos4 1232 -288 R0
WINDOW 0 104 24 Invisible 0
WINDOW 3 179 41 Invisible 0
SYMATTR InstName M16
SYMATTR Value N_50n
SYMATTR Value2 l=50n w=500n
SYMBOL nmos4 1472 -288 R0
WINDOW 0 104 24 Invisible 0
WINDOW 3 179 41 Invisible 0
SYMATTR InstName M17
SYMATTR Value N_50n
SYMATTR Value2 l=50n w=500n
SYMBOL pmos4 1584 544 M180
WINDOW 0 88 9 Invisible 0
WINDOW 3 168 20 Invisible 0
SYMATTR InstName M18
SYMATTR Value P_50n
SYMATTR Value2 l=50n w=1u
SYMBOL pmos4 1808 544 M180
WINDOW 0 88 9 Invisible 0
WINDOW 3 168 20 Invisible 0
SYMATTR InstName M19
SYMATTR Value P_50n
SYMATTR Value2 l=50n w=1u
SYMBOL pmos4 1584 672 M180
WINDOW 0 88 9 Invisible 0
WINDOW 3 168 20 Invisible 0
SYMATTR InstName M20
SYMATTR Value P_50n
SYMATTR Value2 l=50n w=1u
SYMBOL pmos4 1808 672 M180
WINDOW 0 88 9 Invisible 0
WINDOW 3 168 20 Invisible 0
SYMATTR InstName M21
SYMATTR Value P_50n
SYMATTR Value2 l=50n w=1u
SYMBOL nmos4 1584 720 R0
WINDOW 0 104 24 Invisible 0
WINDOW 3 179 41 Invisible 0
SYMATTR InstName M22
SYMATTR Value N_50n
SYMATTR Value2 l=50n w=500n
SYMBOL nmos4 1808 720 R0
WINDOW 0 104 24 Invisible 0
WINDOW 3 179 41 Invisible 0
SYMATTR InstName M23
SYMATTR Value N_50n
SYMATTR Value2 l=50n w=500n
SYMBOL nmos4 1584 864 R0
WINDOW 0 104 24 Invisible 0
WINDOW 3 179 41 Invisible 0
SYMATTR InstName M24
SYMATTR Value N_50n
SYMATTR Value2 l=50n w=500n
SYMBOL nmos4 1808 864 R0
WINDOW 0 104 24 Invisible 0
WINDOW 3 179 41 Invisible 0
SYMATTR InstName M25
SYMATTR Value N_50n
SYMATTR Value2 l=50n w=500n
SYMBOL pmos4 2000 688 M180
WINDOW 0 88 9 Invisible 0
WINDOW 3 168 20 Invisible 0
SYMATTR InstName M26
SYMATTR Value P_50n
SYMATTR Value2 l=50n w=1u
SYMBOL pmos4 2192 688 M180
WINDOW 0 88 9 Invisible 0
WINDOW 3 168 20 Invisible 0
SYMATTR InstName M27
SYMATTR Value P_50n
SYMATTR Value2 l=50n w=1u
SYMBOL nmos4 2000 720 R0
WINDOW 0 104 24 Invisible 0
WINDOW 3 179 41 Invisible 0
SYMATTR InstName M28
SYMATTR Value N_50n
SYMATTR Value2 l=50n w=500n
SYMBOL nmos4 2192 720 R0
WINDOW 0 104 24 Invisible 0
WINDOW 3 179 41 Invisible 0
SYMATTR InstName M29
SYMATTR Value N_50n
SYMATTR Value2 l=50n w=500n
SYMBOL pmos4 416 -64 M180
WINDOW 0 88 9 Invisible 0
WINDOW 3 168 20 Invisible 0
SYMATTR InstName M30
SYMATTR Value P_50n
SYMATTR Value2 l=50n w=1u
SYMBOL nmos4 1232 80 R0
WINDOW 0 104 24 Invisible 0
WINDOW 3 179 41 Invisible 0
SYMATTR InstName M31
SYMATTR Value N_50n
SYMATTR Value2 l=50n w=500n
SYMBOL pmos4 640 -64 M180
WINDOW 0 88 9 Invisible 0
WINDOW 3 168 20 Invisible 0
SYMATTR InstName M32
SYMATTR Value P_50n
SYMATTR Value2 l=50n w=1u
SYMBOL pmos4 1008 48 M180
WINDOW 0 88 9 Invisible 0
WINDOW 3 168 20 Invisible 0
SYMATTR InstName M33
SYMATTR Value P_50n
SYMATTR Value2 l=50n w=1u
SYMBOL pmos4 1232 48 M180
WINDOW 0 88 9 Invisible 0
WINDOW 3 168 20 Invisible 0
SYMATTR InstName M34
SYMATTR Value P_50n
SYMATTR Value2 l=50n w=1u
SYMBOL pmos4 1472 48 M180
WINDOW 0 88 9 Invisible 0
WINDOW 3 168 20 Invisible 0
SYMATTR InstName M35
SYMATTR Value P_50n
SYMATTR Value2 l=50n w=1u
SYMBOL pmos4 1696 48 M180
WINDOW 0 88 9 Invisible 0
WINDOW 3 168 20 Invisible 0
SYMATTR InstName M36
SYMATTR Value P_50n
SYMATTR Value2 l=50n w=1u
SYMBOL pmos4 1888 48 M180
WINDOW 0 88 9 Invisible 0
WINDOW 3 168 20 Invisible 0
SYMATTR InstName M37
SYMATTR Value P_50n
SYMATTR Value2 l=50n w=1u
SYMBOL pmos4 1008 176 M180
WINDOW 0 88 9 Invisible 0
WINDOW 3 168 20 Invisible 0
SYMATTR InstName M38
SYMATTR Value P_50n
SYMATTR Value2 l=50n w=1u
SYMBOL nmos4 416 -32 R0
WINDOW 0 104 24 Invisible 0
WINDOW 3 179 41 Invisible 0
SYMATTR InstName M39
SYMATTR Value N_50n
SYMATTR Value2 l=50n w=500n
SYMBOL nmos4 640 -32 R0
WINDOW 0 104 24 Invisible 0
WINDOW 3 179 41 Invisible 0
SYMATTR InstName M40
SYMATTR Value N_50n
SYMATTR Value2 l=50n w=500n
SYMBOL nmos4 1472 80 R0
WINDOW 0 104 24 Invisible 0
WINDOW 3 179 41 Invisible 0
SYMATTR InstName M41
SYMATTR Value N_50n
SYMATTR Value2 l=50n w=500n
SYMBOL nmos4 1696 80 R0
WINDOW 0 104 24 Invisible 0
WINDOW 3 179 41 Invisible 0
SYMATTR InstName M42
SYMATTR Value N_50n
SYMATTR Value2 l=50n w=500n
SYMBOL nmos4 1888 80 R0
WINDOW 0 104 24 Invisible 0
WINDOW 3 179 41 Invisible 0
SYMATTR InstName M43
SYMATTR Value N_50n
SYMATTR Value2 l=50n w=500n
SYMBOL nmos4 1008 224 R0
WINDOW 0 104 24 Invisible 0
WINDOW 3 179 41 Invisible 0
SYMATTR InstName M44
SYMATTR Value N_50n
SYMATTR Value2 l=50n w=500n
SYMBOL nmos4 1232 224 R0
WINDOW 0 104 24 Invisible 0
WINDOW 3 179 41 Invisible 0
SYMATTR InstName M45
SYMATTR Value N_50n
SYMATTR Value2 l=50n w=500n
SYMBOL nmos4 1472 224 R0
WINDOW 0 104 24 Invisible 0
WINDOW 3 179 41 Invisible 0
SYMATTR InstName M46
SYMATTR Value N_50n
SYMATTR Value2 l=50n w=500n
SYMBOL pmos4 288 528 M180
WINDOW 0 88 9 Invisible 0
WINDOW 3 168 20 Invisible 0
SYMATTR InstName M47
SYMATTR Value P_50n
SYMATTR Value2 l=50n w=1u
SYMBOL pmos4 512 528 M180
WINDOW 0 88 9 Invisible 0
WINDOW 3 168 20 Invisible 0
SYMATTR InstName M48
SYMATTR Value P_50n
SYMATTR Value2 l=50n w=1u
SYMBOL pmos4 288 656 M180
WINDOW 0 88 9 Invisible 0
WINDOW 3 168 20 Invisible 0
SYMATTR InstName M49
SYMATTR Value P_50n
SYMATTR Value2 l=50n w=1u
SYMBOL pmos4 512 656 M180
WINDOW 0 88 9 Invisible 0
WINDOW 3 168 20 Invisible 0
SYMATTR InstName M50
SYMATTR Value P_50n
SYMATTR Value2 l=50n w=1u
SYMBOL nmos4 288 704 R0
WINDOW 0 104 24 Invisible 0
WINDOW 3 179 41 Invisible 0
SYMATTR InstName M51
SYMATTR Value N_50n
SYMATTR Value2 l=50n w=500n
SYMBOL nmos4 512 704 R0
WINDOW 0 104 24 Invisible 0
WINDOW 3 179 41 Invisible 0
SYMATTR InstName M52
SYMATTR Value N_50n
SYMATTR Value2 l=50n w=500n
SYMBOL nmos4 288 848 R0
WINDOW 0 104 24 Invisible 0
WINDOW 3 179 41 Invisible 0
SYMATTR InstName M53
SYMATTR Value N_50n
SYMATTR Value2 l=50n w=500n
SYMBOL nmos4 512 848 R0
WINDOW 0 104 24 Invisible 0
WINDOW 3 179 41 Invisible 0
SYMATTR InstName M54
SYMATTR Value N_50n
SYMATTR Value2 l=50n w=500n
SYMBOL pmos4 704 672 M180
WINDOW 0 88 9 Invisible 0
WINDOW 3 168 20 Invisible 0
SYMATTR InstName M55
SYMATTR Value P_50n
SYMATTR Value2 l=50n w=1u
SYMBOL pmos4 896 672 M180
WINDOW 0 88 9 Invisible 0
WINDOW 3 168 20 Invisible 0
SYMATTR InstName M56
SYMATTR Value P_50n
SYMATTR Value2 l=50n w=1u
SYMBOL nmos4 704 704 R0
WINDOW 0 104 24 Invisible 0
WINDOW 3 179 41 Invisible 0
SYMATTR InstName M57
SYMATTR Value N_50n
SYMATTR Value2 l=50n w=500n
SYMBOL nmos4 896 704 R0
WINDOW 0 104 24 Invisible 0
WINDOW 3 179 41 Invisible 0
SYMATTR InstName M58
SYMATTR Value N_50n
SYMATTR Value2 l=50n w=500n
SYMBOL pmos4 416 240 M180
WINDOW 0 88 9 Invisible 0
WINDOW 3 168 20 Invisible 0
SYMATTR InstName M59
SYMATTR Value P_50n
SYMATTR Value2 l=50n w=1u
SYMBOL pmos4 720 240 M180
WINDOW 0 88 9 Invisible 0
WINDOW 3 168 20 Invisible 0
SYMATTR InstName M60
SYMATTR Value P_50n
SYMATTR Value2 l=50n w=1u
SYMBOL nmos4 416 272 R0
WINDOW 0 104 24 Invisible 0
WINDOW 3 179 41 Invisible 0
SYMATTR InstName M61
SYMATTR Value N_50n
SYMATTR Value2 l=50n w=500n
SYMBOL nmos4 720 272 R0
WINDOW 0 104 24 Invisible 0
WINDOW 3 179 41 Invisible 0
SYMATTR InstName M62
SYMATTR Value N_50n
SYMATTR Value2 l=50n w=500n
SYMBOL cap 608 256 R0
WINDOW 0 37 20 Left 0
WINDOW 3 32 52 Left 0
SYMATTR InstName C1
SYMATTR Value 100f
TEXT 536 192 Left 0 ;Added delay
TEXT 1056 448 Left 0 !.lib cmosedu_models.txt

The netlist it stands for:
* Fig19_74.asc
VNRZ NRZ 0 PULSE 0 1 0 10p 10p 0.9n 2n
VDD VDD 0 1
XU4 up upi VDD 0 inv_20_10
M1 Vinvco down N006 0 N_50n l=50n w=500n
M2 Vinvco upi N002 VDD P_50n l=50n w=1u
XU5 down downi VDD 0 inv_20_10
C2 Vinvco 0 350f
M3 N003 downi N006 0 N_50n l=50n w=500n
M4 N003 up N002 VDD P_50n l=50n w=1u
M5 N002 N001 VDD VDD P_50n l=100n w=5u
M6 N001 N001 VDD VDD P_50n l=100n w=5u
M7 N006 N005 0 0 N_50n l=100n w=2.5u
M8 N005 N005 0 0 N_50n l=100n w=2.5u
I1 N001 N005 10µ
Vref Vref 0 500m
XU2 N007 clock clock N007 Vinvco Vref VDD 0 fig_19_63
C1 Vinvco N004 3.5p
R1 N004 0 5k
XU1 NRZ clock up down VDD 0 hogge_pd

* block symbol definitions
.subckt inv_20_10 In Out VDD GND
M1 Out In GND GND N_50n l=50n w=500n
M2 Out In VDD VDD P_50n l=50n w=1u
* 20/1
* 10/1
.lib cmosedu_models.txt
.ends inv_20_10

.subckt fig_19_63 Inp Inm Outp Outm Vindel Vref VDD GND
M1 N013 N013 GND 0 N_50n l=50n w=500n
M3 N013 n2 N011 VDD P_50n l=50n w=1u
M4 Vrbias VREF N011 VDD P_50n l=50n w=1u
M2 Vrbias N013 0 0 N_50n l=50n w=500n
M5 Vpbias Vpbias VDD VDD P_50n l=50n w=1u
M7 n2 Vrbias 0 0 N_50n l=50n w=500n
M6 N011 N013 VDD VDD P_50n l=50n w=1u
Mref Vpbias Vindel P001 0 N_50n l=50n w=5u
R1 P001 0 10k
M8 N009 Vpbias VDD VDD P_50n l=50n w=10u
M9 n2 0 N009 VDD P_50n l=50n w=1u
M10 n2 n2 0 0 N_50n l=100n w=500n
XU1 Inp Inm N004 N006 Vpbias Vrbias VDD 0 delay
XU3 N004 N006 Out2 N007 Vpbias Vrbias VDD 0 delay
XU4 Out2 N007 N005 N008 Vpbias Vrbias VDD 0 delay
XU5 N005 N008 Out4 Out4i Vpbias Vrbias VDD 0 delay
XU6 Out4 Out4i N001 N002 Vpbias Vrbias VDD 0 delay
XU7 N001 N002 Out6 N003 Vpbias Vrbias VDD 0 delay
XU8 Out6 N003 Out7 Out7i Vpbias Vrbias VDD 0 delay
XU10 Out7 Out7i N010 Vpbias VDD 0 pdiff
XU11 Out7i Out7 N012 Vpbias VDD 0 pdiff
XU12 N010 Outm VDD 0 inv_20_10
XU13 N012 Outp VDD 0 inv_20_10
.include cmosedu_models.txt
.ends fig_19_63

.subckt delay Inp Inm Outp Outm Vpbias Vrbias VDD GND
M1 Outp Vrbias GND 0 N_50n l=50n w=500n
M4 N001 Vpbias VDD VDD P_50n l=50n w=10u
M3 Outp Inm N001 VDD P_50n l=50n w=1u
M2 Outp Outp 0 0 N_50n l=100n w=500n
M5 Outm Inp N001 VDD P_50n l=50n w=1u
M6 Outm Vrbias 0 0 N_50n l=50n w=500n
M7 Outm Outm 0 0 N_50n l=100n w=500n
C1 0 Outp 5f
C2 Outm 0 5f
.include cmosedu_models.txt
* model parasitic C
* (important)
.ends delay

.subckt pdiff Inp Inm Out Vpbias VDD GND
M4 N001 Vpbias VDD VDD P_50n l=50n w=10u
M3 N002 Inp N001 VDD P_50n l=50n w=1u
M5 Out Inm N001 VDD P_50n l=50n w=1u
M6 N002 N002 GND 0 N_50n l=50n w=500n
M7 Out N002 0 0 N_50n l=50n w=500n
.lib cmosedu_models.txt
.ends pdiff

.subckt hogge_pd NRZ Clock Increase Decrease VDD GND
M3 di NRZ VDD VDD P_50n l=50n w=1u
M7 N010 N007 N011 0 N_50n l=50n w=500n
M1 d di VDD VDD P_50n l=50n w=1u
M2 N006 d VDD VDD P_50n l=50n w=1u
M4 N010 c VDD VDD P_50n l=50n w=1u
M5 Ai N010 VDD VDD P_50n l=50n w=1u
M6 A Ai VDD VDD P_50n l=50n w=1u
M8 Aii A VDD VDD P_50n l=50n w=1u
M9 N007 c N006 VDD P_50n l=50n w=1u
M10 di NRZ GND 0 N_50n l=50n w=500n
M11 d di 0 0 N_50n l=50n w=500n
M12 Ai c N014 0 N_50n l=50n w=500n
M13 A Ai 0 0 N_50n l=50n w=500n
M14 Aii A 0 0 N_50n l=50n w=500n
M15 N007 d 0 0 N_50n l=50n w=500n
M16 N011 c 0 0 N_50n l=50n w=500n
M17 N014 N010 0 0 N_50n l=50n w=500n
M18 N016 B VDD VDD P_50n l=50n w=1u
M19 N016 A VDD VDD P_50n l=50n w=1u
M20 N017 Bii N016 VDD P_50n l=50n w=1u
M21 N017 Aii N016 VDD P_50n l=50n w=1u
M22 N017 B N018 0 N_50n l=50n w=500n
M23 N017 Bii N019 0 N_50n l=50n w=500n
M24 N018 A 0 0 N_50n l=50n w=500n
M25 N019 Aii 0 0 N_50n l=50n w=500n
M26 N020 N017 VDD VDD P_50n l=50n w=1u
M27 Decrease N020 VDD VDD P_50n l=50n w=1u
M28 N020 N017 0 0 N_50n l=50n w=500n
M29 Decrease N020 0 0 N_50n l=50n w=500n
M30 ci clock VDD VDD P_50n l=50n w=1u
M31 N012 N009 N013 0 N_50n l=50n w=500n
M32 c ci VDD VDD P_50n l=50n w=1u
M33 N008 A VDD VDD P_50n l=50n w=1u
M34 N012 ci VDD VDD P_50n l=50n w=1u
M35 Bi N012 VDD VDD P_50n l=50n w=1u
M36 B Bi VDD VDD P_50n l=50n w=1u
M37 Bii B VDD VDD P_50n l=50n w=1u
M38 N009 ci N008 VDD P_50n l=50n w=1u
M39 ci clock 0 0 N_50n l=50n w=500n
M40 c ci 0 0 N_50n l=50n w=500n
M41 Bi ci N015 0 N_50n l=50n w=500n
M42 B Bi 0 0 N_50n l=50n w=500n
M43 Bii B 0 0 N_50n l=50n w=500n
M44 N009 A 0 0 N_50n l=50n w=500n
M45 N013 ci 0 0 N_50n l=50n w=500n
M46 N015 N012 0 0 N_50n l=50n w=500n
M47 N001 dii VDD VDD P_50n l=50n w=1u
M48 N001 A VDD VDD P_50n l=50n w=1u
M49 N002 diii N001 VDD P_50n l=50n w=1u
M50 N002 Aii N001 VDD P_50n l=50n w=1u
M51 N002 dii N003 0 N_50n l=50n w=500n
M52 N002 diii N004 0 N_50n l=50n w=500n
M53 N003 A 0 0 N_50n l=50n w=500n
M54 N004 Aii 0 0 N_50n l=50n w=500n
M55 N005 N002 VDD VDD P_50n l=50n w=1u
M56 Increase N005 VDD VDD P_50n l=50n w=1u
M57 N005 N002 0 0 N_50n l=50n w=500n
M58 Increase N005 0 0 N_50n l=50n w=500n
M59 diii d VDD VDD P_50n l=50n w=1u
M60 dii diii VDD VDD P_50n l=50n w=1u
M61 diii d 0 0 N_50n l=50n w=500n
M62 dii diii 0 0 N_50n l=50n w=500n
C1 diii 0 100f
* Added delay
.lib cmosedu_models.txt
.ends hogge_pd

.model NMOS NMOS
.model PMOS PMOS
.lib standard.mos
.tran 500n uic
.include cmosedu_models.txt
* Plot Vinvco and then NRZ+1.25 clock
.backanno
.end